# Altium schematic sheet power.SchDoc
size A4; SheetNumber: 4; SheetTotal: 5
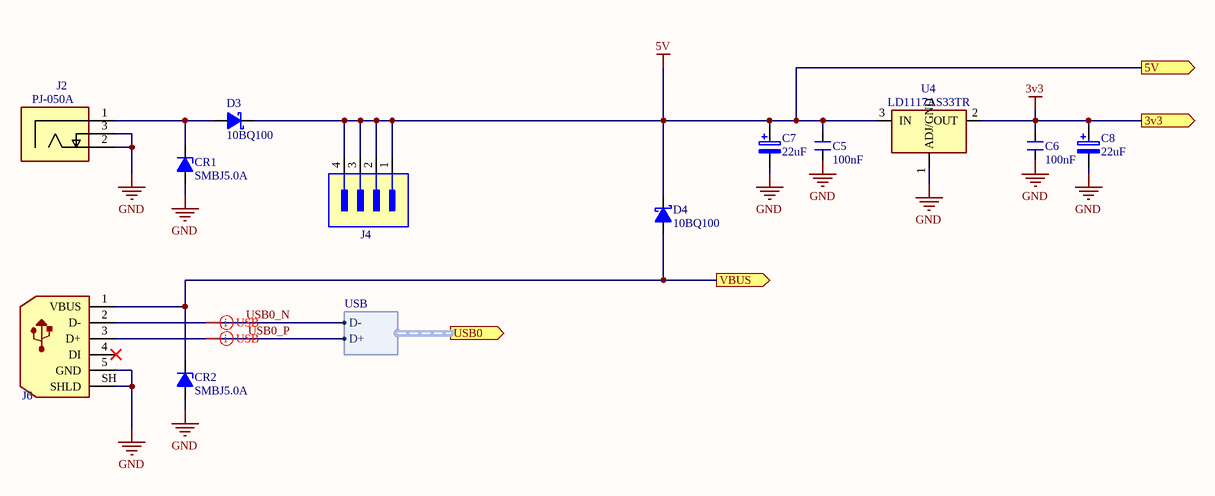
[diagram p0: power.SchDoc]

## Parts
C5  100nF  [CAP0603]
C6  100nF  [CAP0603]
C7  22uF  [CAP TANT B]
C8  22uF  [CAP TANT B]
CR1  SMBJ5.0A  [DO-214AA-2_SMB]
CR2  SMBJ5.0A  [DO-214AA-2_SMB]
D3  10BQ100  [DO-214AA-2_SMB]
D4  10BQ100  [DO-214AA-2_SMB]
J2  PJ-050A  [CUI_PJ050A]
J4  PM254-2-02-Z-8.5  [254-2-2-Fem]  (value not drawn)
J6  micro-USB female  [GCT_USB_Micro_B]  (value not drawn)
U4  LD1117AS33TR  [SOT-223]

## Ports
3v3 (out), 5V (out), USB0 (out, harness USB), VBUS (out)

## Harnesses
USB: D-, D+

## Nets
3v3: C6.2 C8.1 U4.2(OUT) ; port 3v3
5V: C5.2 C7.1 D3.1(C) D4.1(C) J4.1 J4.2 J4.3 J4.4 U4.3(IN) ; port 5V
GND: C5.1 C6.1 C7.2 C8.2 CR1.2(A) CR2.2(A) J2.2 J2.3 J6.5(GND) J6.SH(SHLD) U4.1(ADJ/GND)
USB0_N: J6.2(D-) ; port USB0.D-
USB0_P: J6.3(D+) ; port USB0.D+
VBUS: CR2.1(C) D4.2(A) J6.1(VBUS) ; port VBUS
NetCR1_1: CR1.1(C) D3.2(A) J2.1

Not connected (* = marked no-connect by the designer): J6 4(DI)*

## Layout directives
differential pair; differential pair class USB: USB0_N, USB0_P

## Library data of the parts
C5 C6 = GCM188R71H104KA57J: Tolerance ±10% / Rated Voltage 50Vdc / Temperature 0±30ppm/℃; Manufacturer: Arrow Electronics; Item: 100nF 50V  ±10%; Vdc: 50V; Part Number: GCM188R71H104KA57J; Supplier 1: Mouser; Supplier Part Number 1: 81-GCM188R71H104KA7J; Case: 0603; Tolerance: 10%; Value: 100nF; HelpURL: http://www.farnell.com/datasheets/4360.pdf?src-supplier=Element14; Category: Multilayer Ceramic Capacitors - SMD/SMT
C7 C8 = TAJB226K016RNJ: Tolerance ±10% / Type Molded / ESR (Equivalent Series Resistance) 2,3Ohm / Operating Temperature -55°C ~ 125°C; Manufacturer: KYOCERA AVX; Item: 22uF 16V ±10%; Vdc: 16V; Part Number: TAJB226K016RNJ; Supplier 1: Mouser; Supplier Part Number 1: 581-TAJB226K016; Case: Manufacturer Size Code B; Tolerance: 10%; Value: 22uF; HelpURL: https://eu.mouser.com/datasheet/2/40/TAJ-3165264.pdf; Category: Tantalum Capacitors - Solid SMD
CR1 CR2 = SMBJ5.0A: ESD Suppressors / TVS Diodes 600W 5V Unidirect; Manufacturer: Bourns; Item: SMBJ5.0A; Part Number: SMBJ5.0A; Supplier 1: Mouser; Vdss: 5V; Case: DO-214AA-2; HelpURL: https://eu.mouser.com/datasheet/2/54/smbj-778392.pdf; Category: ESD Suppressors / TVS Diodes
D3 D4 = 10BQ100: Schottky Diodes & Rectifiers 1A 100V Single Die Schottky Rectifier; Manufacturer: Hottech; Type: Diode Schottky; Id: 1А; Part Number: 10BQ100; Item: 10BQ100; Supplier 1: ChipDip; Supplier Part Number 1: 9000970121; Vdss: 100V; Case: DO-214AA-2; HelpURL: https://static.chipdip.ru/lib/751/DOC015751074.pdf; Category: Schottky Diodes & Rectifiers
J2 = PJ-050A: DC Power Connectors Power Jacks Right Angle; Manufacturer Part Number: MJ-2506N; Manufacturer: CUI Devices; Supplier 1: Mouser; Supplier Part Number 1: 490-PJ-050A; Part Number: PJ-050A; Item: PJ-050A; Case: Female; HelpURL: https://eu.mouser.com/datasheet/2/670/pj_050a-1778816.pdf; Category: DC Power Connectors
J4 = PM254-2-02-Z-8.5: 2.54mm 2.54mm 3A Copper Alloy 4P -40℃~+105℃ 260℃@5S Straight 2x2P 8.5mm Top Square Holes Plugin,P=2.54mm Female Headers ROHS; Manufacturer: HCTL; Item: Header 2.54 2x2 Female; Supplier 1: LCSC; Supplier Part Number 1: C2897403; Case: Female; Part Number: PM254-2-02-Z-8.5; HelpURL: https://datasheet.lcsc.com/lcsc/2306091005_HCTL-PM254-2-02-Z-8-5_C2897403.pdf?_gl=1*j2h43v*_ga*MTA1Mzg1NzAxMC4xNzEyNDA1NTIz*_ga_98M84MKSZH*MTcxNzc5MzMyMy44LjEuMTcxNzc5NDE5OC40My4wLjA.; Category: Headers & Wire Housings
J6 = 640-USB3076-30-A: USB Connectors Micro B Skt, Bottom-SMT, R/A, 30u, No Peg, W/shell stake, No MEF,T&R; Manufacturer: GCT; Item: USB-Micro; Part Number: 640-USB3076-30-A; Supplier 1: Mouser; Case: Female; HelpURL: https://eu.mouser.com/datasheet/2/837/USB3076-2888220.pdf; Category: USB Connectors
U4 = LD1117AS33TR: Linear Voltage Regulators 3.3V 1A Positive; Manufacturer: STMicroelectronics; Output Voltage: 3,3; Input Voltage, Max: 10; Part Number: LD1117AS33TR; Item: LD1117A; Supplier 1: Chipdip; Supplier Part Number 1: LD1117AS33TR; Case: SOT-223; HelpURL: https://static.chipdip.ru/lib/918/DOC012918569.pdf; Category: Linear Voltage Regulators; Output Current: 1 A